# Altium schematic sheet Pico-CRSF.SchDoc: Drone RF RX & CRSF
size 420 x 297 mm; Project: Drone; ENG_APP_DATE: --/--/--; DSN_APP_DATE: --/--/--; CHK_APP_DATE: --/--/--; Date: 2024 02 04; Author: Samuel Fox; CompanyName: Exeter University; DrawnBy: Samuel Fox; Engineer: Samuel Fox; Revision: 0.1; SheetNumber: 1; SheetTotal: 1; Time: 0900
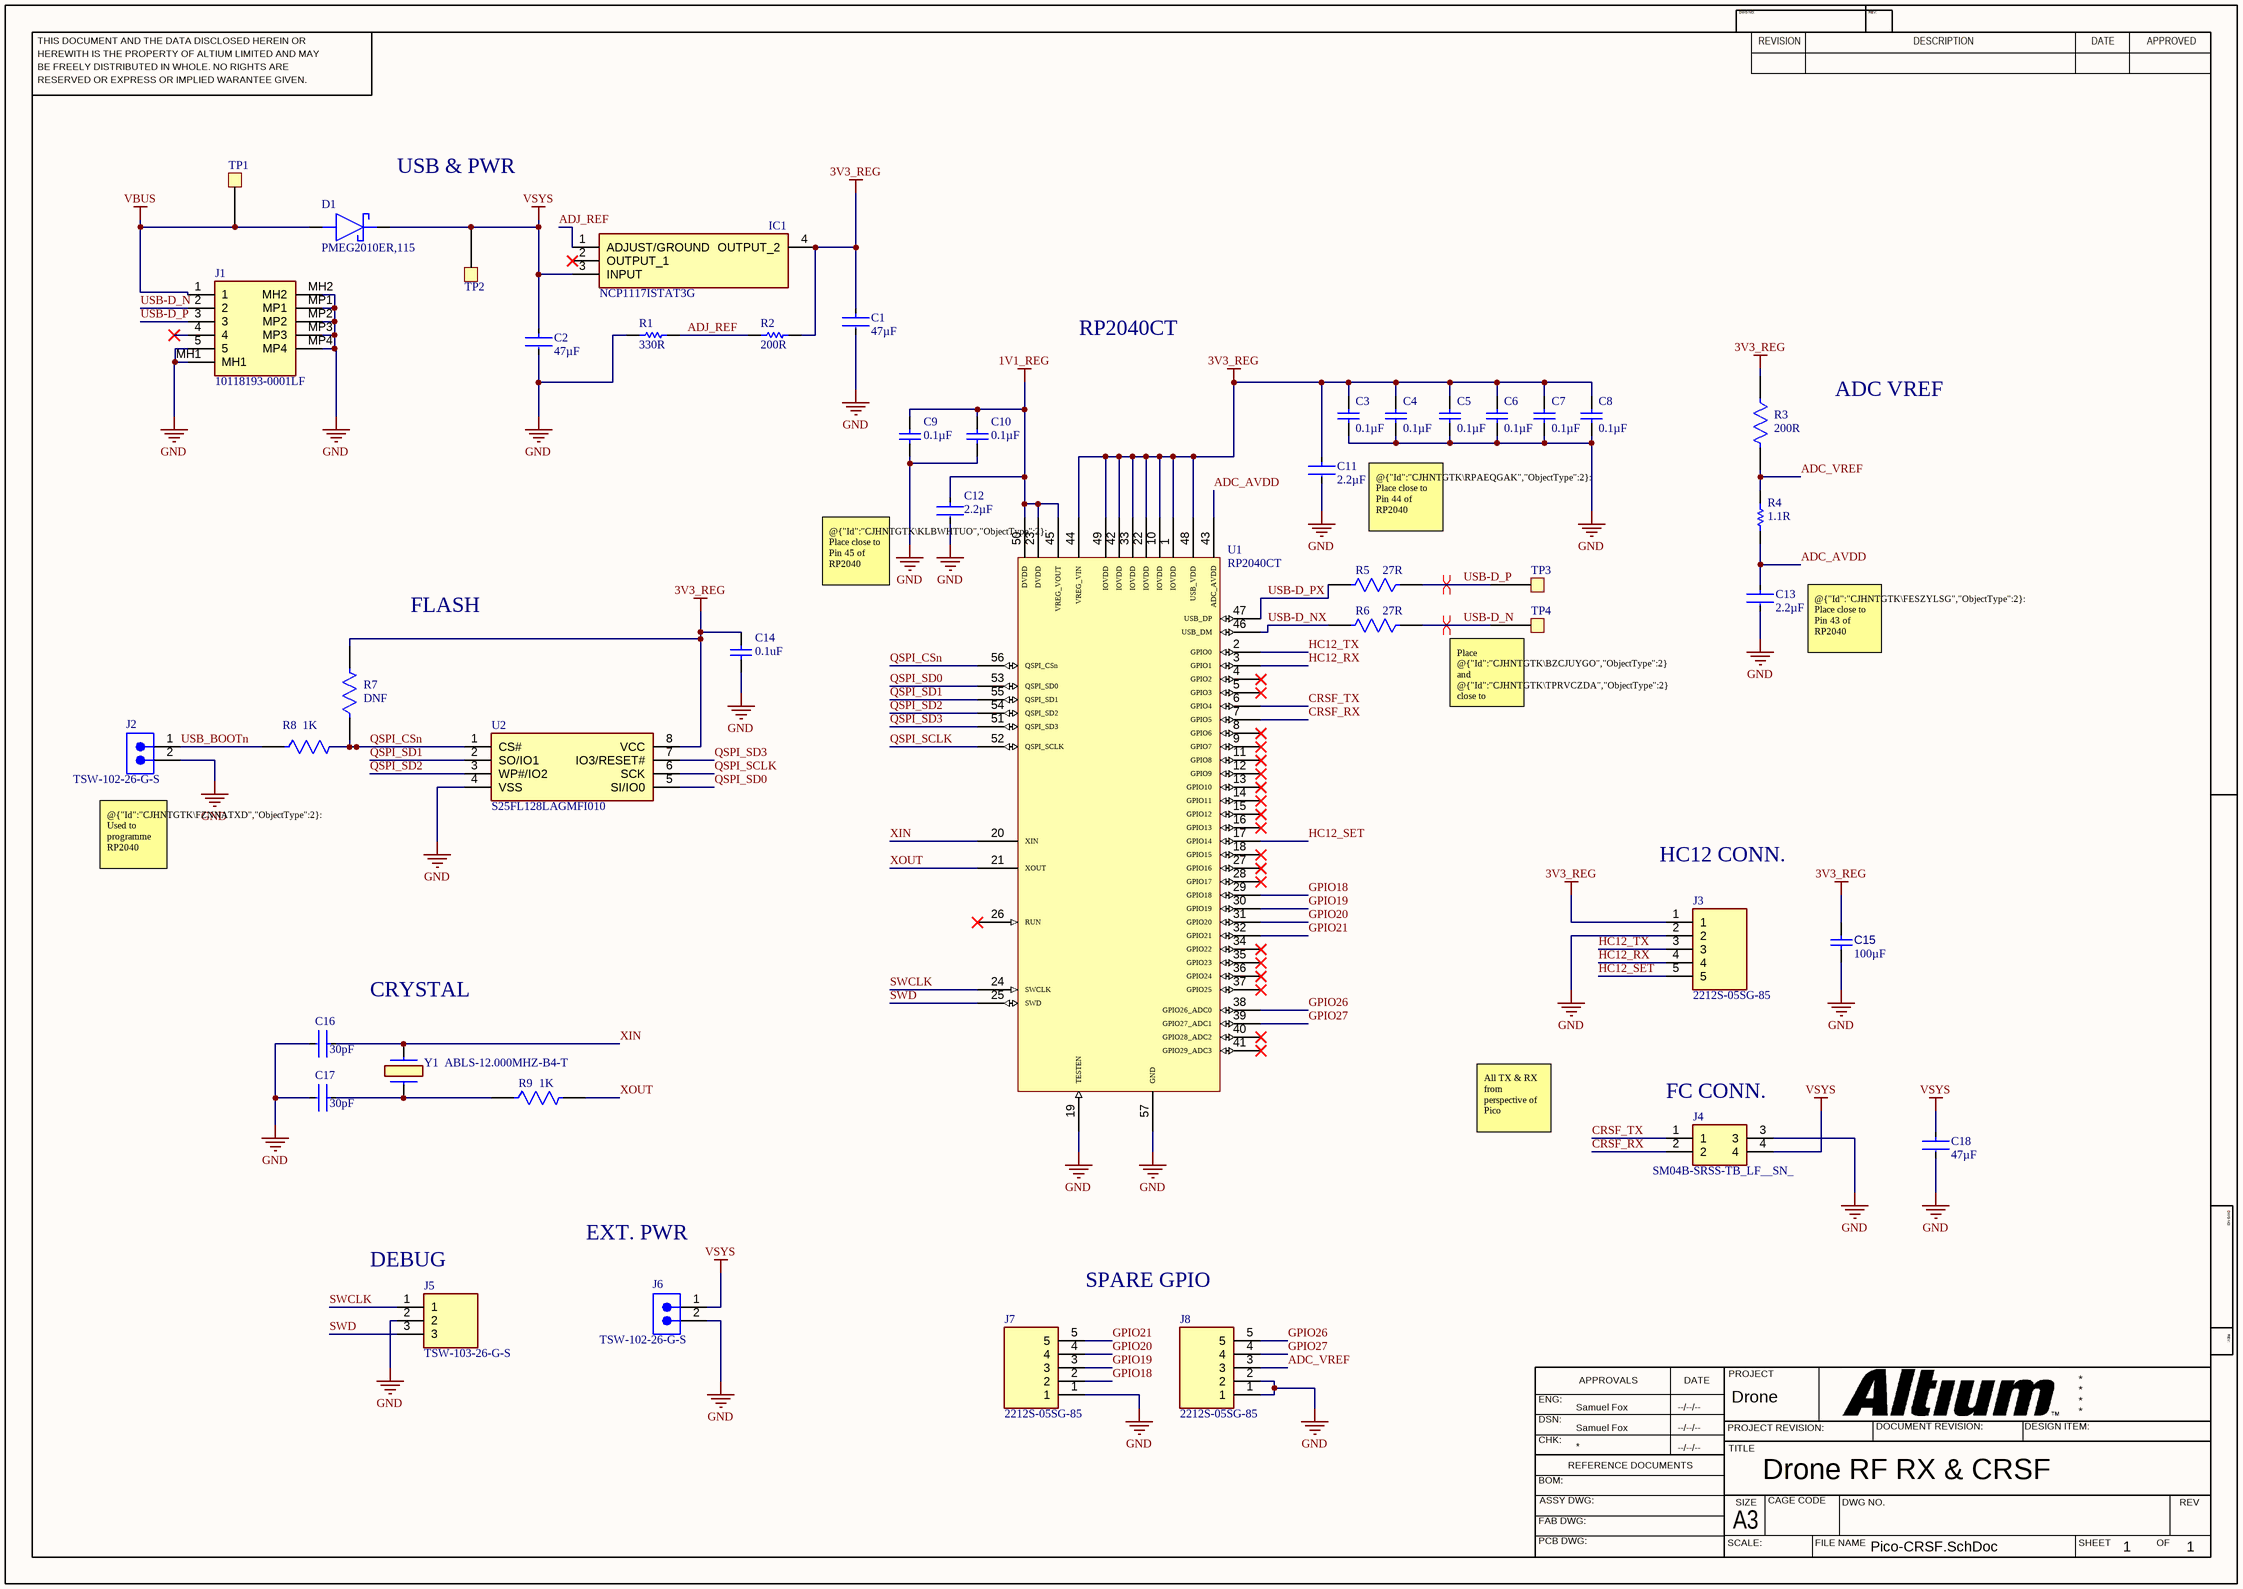
[diagram p0: Pico-CRSF.SchDoc]

## Parts
C1  value 47µF  [FP-GRT21B-0_2-MFG]  (hidden comment: GRT21BR60J476ME13L)
C2  value 47µF  [FP-GRT21B-0_2-MFG]  (hidden comment: GRT21BR60J476ME13L)
C3  value 0.1µF  [CAPC1005X56X25LL10T15]  (hidden comment: 04026D104KAT2A)
C4  value 0.1µF  [CAPC1005X56X25LL10T15]  (hidden comment: 04026D104KAT2A)
C5  value 0.1µF  [CAPC1005X56X25LL10T15]  (hidden comment: 04026D104KAT2A)
C6  value 0.1µF  [CAPC1005X56X25LL10T15]  (hidden comment: 04026D104KAT2A)
C7  value 0.1µF  [CAPC1005X56X25LL10T15]  (hidden comment: 04026D104KAT2A)
C8  value 0.1µF  [CAPC1005X56X25LL10T15]  (hidden comment: 04026D104KAT2A)
C9  value 0.1µF  [CAPC1005X56X25LL10T15]  (hidden comment: 04026D104KAT2A)
C10  value 0.1µF  [CAPC1005X56X25LL10T15]  (hidden comment: 04026D104KAT2A)
C11  value 2.2µF  [FP-GRM155-0_05-MFG]  (hidden comment: GRM155D80J225ME95D)
C12  value 2.2µF  [FP-GRM155-0_05-MFG]  (hidden comment: GRM155D80J225ME95D)
C13  value 2.2µF  [FP-GRM155-0_05-MFG]  (hidden comment: GRM155D80J225ME95D)
C14  value 0.1uF  [CAPC1005X56X25LL10T15]  (hidden comment: 04026D104KAT2A)
C15  value 100µF  [CAPC3216X16N]  (hidden comment: CL31A107MQHNNNE)
C16  value 30pF  [FP-GCM155-0_05-IPC_A]  (hidden comment: GCM1555C1H300JA16D)
C17  value 30pF  [FP-GCM155-0_05-IPC_A]  (hidden comment: GCM1555C1H300JA16D)
C18  value 47µF  [FP-GRT21B-0_2-MFG]  (hidden comment: GRT21BR60J476ME13L)
D1  PMEG2010ER,115  [PMEG2010ER115]
IC1  NCP1117ISTAT3G  [SOT230P700X180-4N]
J1  10118193-0001LF  [101181930001LF]
J2  TSW-102-26-G-S  [SMTC-TSW-102-26-XX-S]
J3  2212S-05SG-85  [RHDR5W74P0X254_1X5_1320X250X850P]
J4  SM04B-SRSS-TB_LF__SN_  [SM04B-SRSS-TB(LFSN)]
J5  TSW-103-26-G-S  [TSW-103-XX-YY-S]
J6  TSW-102-26-G-S  [SMTC-TSW-102-26-XX-S]
J7  2212S-05SG-85  [RHDR5W74P0X254_1X5_1320X250X850P]
J8  2212S-05SG-85  [RHDR5W74P0X254_1X5_1320X250X850P]
R1  value 330R  [RESC1005X40X25NL05T10]  (hidden comment: RC0402JR-07300RL)
R2  value 200R  [RESC1005X40X25NL05T10]  (hidden comment: RC0402FR-07180RL)
R3  value 200R  [FP-CR0402-IPC_C]  (hidden comment: CR0402-FX-2000GLF)
R4  value 1.1R  [RESC1005X40X25NL05T10]  (hidden comment: RC0402FR-071R)
R5  value 27R  [FP-CR0402-IPC_C]  (hidden comment: CR0402-FX-27R0GLF)
R6  value 27R  [FP-CR0402-IPC_C]  (hidden comment: CR0402-FX-27R0GLF)
R7  value DNF  [FP-CR0402-IPC_C]  (hidden comment: CR0402AFX-1001GAS)
R8  value 1K  [FP-CR0402-IPC_C]  (hidden comment: CR0402AFX-1001GAS)
R9  value 1K  [FP-CR0402-IPC_C]  (hidden comment: CR0402AFX-1001GAS)
TP1  TestPoint  [TestPoint-Footprint-1]  (value not drawn)  (no BOM)
TP2  TestPoint  [TestPoint-Footprint-1]  (value not drawn)  (no BOM)
TP3  TestPoint  [TestPoint-Footprint-1]  (value not drawn)  (no BOM)
TP4  TestPoint  [TestPoint-Footprint-1]  (value not drawn)  (no BOM)
U1  RP2040CT  [QFN40P700X700X90_HS-57N]
U2  S25FL128LAGMFI010  [SOIC127P800X216-8N]
Y1  ABLS-12.000MHZ-B4-T  [ABLS]

## Nets
1V1_REG: C9.1 C10.1 C12.1 U1.23(DVDD) U1.45(VREG_VOUT) U1.50(DVDD)
3V3_REG: C1.1 C3.1 C4.1 C5.1 C6.1 C7.1 C8.1 C11.1 C14.1 C15.1 IC1.4(OUTPUT_2) J3.1 R2.2 R3.1 R7.2 U1.1(IOVDD) U1.10(IOVDD) U1.22(IOVDD) U1.33(IOVDD) U1.42(IOVDD) U1.44(VREG_VIN) U1.48(USB_VDD) U1.49(IOVDD) U2.8(VCC)
GND: C1.2 C2.2 C3.2 C4.2 C5.2 C6.2 C7.2 C8.2 C9.2 C10.2 C11.2 C12.2 C13.2 C14.2 C15.2 C16.2 C17.2 C18.2 J1.5 J1.MH1 J1.MH2 J1.MP1 J1.MP2 J1.MP3 J1.MP4 J2.2 J3.2 J4.3 J5.2 J6.2 J7.1 J8.1 J8.2 R1.1 U1.19(TESTEN) U1.57(GND) U2.4(VSS)
VBUS: D1.2(A) J1.1 TP1.1
VSYS: C2.1 C18.1 D1.1(K) IC1.3(INPUT) J4.4 J6.1 TP2.1
ADC_AVDD: C13.1 R4.2 U1.43(ADC_AVDD)
ADC_VREF: J8.3 R3.2 R4.1
ADJ_REF: IC1.1(ADJUST/GROUND) R1.2 R2.1
CRSF_RX: J4.2 U1.7(GPIO5)
CRSF_TX: J4.1 U1.6(GPIO4)
GPIO18: J7.2 U1.29(GPIO18)
GPIO19: J7.3 U1.30(GPIO19)
GPIO20: J7.4 U1.31(GPIO20)
GPIO21: J7.5 U1.32(GPIO21)
GPIO26: J8.5 U1.38(GPIO26_ADC0)
GPIO27: J8.4 U1.39(GPIO27_ADC1)
HC12_RX: J3.4 U1.3(GPIO1)
HC12_SET: J3.5 U1.17(GPIO14)
HC12_TX: J3.3 U1.2(GPIO0)
QSPI_CSn: R7.1 R8.2 U1.56(QSPI_CSn) U2.1(CS#)
QSPI_SCLK: U1.52(QSPI_SCLK) U2.6(SCK)
QSPI_SD0: U1.53(QSPI_SD0) U2.5(SI/IO0)
QSPI_SD1: U1.55(QSPI_SD1) U2.2(SO/IO1)
QSPI_SD2: U1.54(QSPI_SD2) U2.3(WP#/IO2)
QSPI_SD3: U1.51(QSPI_SD3) U2.7(IO3/RESET#)
SWCLK: J5.1 U1.24(SWCLK)
SWD: J5.3 U1.25(SWD)
USB-D_N: J1.2 R6.1 TP4.1
USB-D_NX: R6.2 U1.46(USB_DM)
USB-D_P: J1.3 R5.1 TP3.1
USB-D_PX: R5.2 U1.47(USB_DP)
USB_BOOTn: J2.1 R8.1
XIN: C16.1 U1.20(XIN) Y1.1
XOUT: R9.2 U1.21(XOUT)
NetC17_1: C17.1 R9.1 Y1.2

Not connected (* = marked no-connect by the designer): IC1 2(OUTPUT_1)*; J1 4*; U1 4(GPIO2)* 5(GPIO3)* 8(GPIO6)* 9(GPIO7)* 11(GPIO8)* 12(GPIO9)* 13(GPIO10)* 14(GPIO11)* 15(GPIO12)* 16(GPIO13)* 18(GPIO15)* 26(RUN)* 27(GPIO16)* 28(GPIO17)* 34(GPIO22)* 35(GPIO23)* 36(GPIO24)* 37(GPIO25)* 40(GPIO28_ADC2)* 41(GPIO29_ADC3)*

## Layout directives
differential pair: USB-D_N, USB-D_P

## Notes on the sheet
- (near D1) USB & PWR
- RP2040CT
- ADC VREF
- @{"Id":"CJHNTGTK\RPAEQGAK","ObjectType":2}: Place close to Pin 44 of RP2040
- @{"Id":"CJHNTGTK\KLBWHTUO","ObjectType":2}: Place close to Pin 45 of RP2040
- FLASH
- @{"Id":"CJHNTGTK\FESZYLSG","ObjectType":2}: Place close to Pin 43 of RP2040
- (near TP4) Place @{"Id":"CJHNTGTK\BZCJUYGO","ObjectType":2} and @{"Id":"CJHNTGTK\TPRVCZDA","ObjectType":2} close to RP2040
- (near J2) @{"Id":"CJHNTGTK\FZNNATXD","ObjectType":2}: Used to programme RP2040
- HC12 CONN.
- CRYSTAL
- All TX & RX from perspective of Pico
- (near J4) FC CONN.
- (near J5) DEBUG
- EXT. PWR
- SPARE GPIO
- THIS DOCUMENT AND THE DATA DISCLOSED HEREIN OR
- HEREWITH IS THE PROPERTY OF ALTIUM LIMITED AND MAY
- DWG NO:
- REVISION
- REV:
- DESCRIPTION
- DATE
- APPROVED
- BE FREELY DISTRIBUTED IN WHOLE. NO RIGHTS ARE
- RESERVED OR EXPRESS OR IMPLIED WARANTEE GIVEN.
- ENG:
- APPROVALS
- PROJECT
- DSN:
- CHK:
- REFERENCE DOCUMENTS
- PROJECT REVISION:
- TITLE
- DOCUMENT REVISION:
- DESIGN ITEM:
- BOM:
- FAB DWG:
- PCB DWG:
- ASSY DWG:
- SCALE:
- A3
- SIZE
- CAGE CODE
- FILE NAME
- DWG NO.
- SHEET
- OF
- REV

## Library data of the parts
C1 C2 C18 = CMP-001-00084-1: Ceramic Capacitor, Multilayer, Ceramic, 6.3V, 20% +Tol, 20% -Tol, X5R, 15% TC, 47uF, Surface Mount, 0805; Max Operating Temperature: 85°C; Pins: 2; Case/Package: 0805; Mounting Technology: Surface Mount; Capacitor Type: Ceramic; Min Operating Temperature: -55°C; RoHS Compliant: Yes
C3-C10 C14 = CMP-001-00085-1: Ceramic Capacitor, Multilayer, Ceramic, 6.3V, 10% +Tol, 10% -Tol, X5R, 15% TC, 0.1uF, Surface Mount, 0402; Max Operating Temperature: 85°C; Pins: 2; Case/Package: 0402; Mounting Technology: Surface Mount; Capacitor Type: Ceramic; Min Operating Temperature: -55°C; RoHS Compliant: Yes
C11-C13 = CMP-001-00086-1: Ceramic Capacitor, Multilayer, Ceramic, 6.3V, 20% +Tol, 20% -Tol, X6T, -33/+22% TC, 2.2uF, Surface Mount, 0402; Max Operating Temperature: 105°C; Pins: 2; Case/Package: 0402; Mounting Technology: Surface Mount; Capacitor Type: Ceramic; Min Operating Temperature: -55°C; RoHS Compliant: Yes
C15 = CMP-001-00089-1: Ceramic Capacitor, Multilayer, Ceramic, 6.3V, 20% +Tol, 20% -Tol, X5R, 15% TC, 100uF, Surface Mount, 1206; Max Operating Temperature: 85°C; Pins: 2; Case/Package: 1206; Mounting Technology: Surface Mount; Capacitor Type: Ceramic; Min Operating Temperature: -55°C; RoHS Compliant: Yes
C16 C17 = CMP-001-00088-1: Ceramic Capacitor, Multilayer, Ceramic, 50V, 5% +Tol, 5% -Tol, C0G, 30ppm/Cel TC, 0.00003uF, Surface Mount, 0402; Max Operating Temperature: 125°C; Pins: 2; Case/Package: 0402; Mounting Technology: Surface Mount; Capacitor Type: Ceramic; Min Operating Temperature: -55°C; RoHS Compliant: Yes
D1 = PMEG2010ER,115: Schottky Diode; Manufacturer_Name: Nexperia; Datasheet Link: https://assets.nexperia.com/documents/data-sheet/PMEG2010ER.pdf; Height: 1.1mm; Manufacturer_Part_Number: PMEG2010ER,115; Mouser Part Number: 771-PMEG2010ER115; Mouser Price/Stock: https://www.mouser.co.uk/ProductDetail/Nexperia/PMEG2010ER115?qs=LMSg3oBIm%2FjLN28PGE8ULg%3D%3D; Arrow Part Number: PMEG2010ER,115; Arrow Price/Stock: https://www.arrow.com/en/products/pmeg2010er115/nexperia?region=nac
IC1 = NCP1117ISTAT3G: Integrated Circuit; Manufacturer_Name: onsemi; Datasheet Link: https://www.mouser.in/datasheet/2/308/NCP1117_D-2307187.pdf; Height: 1.8mm; Manufacturer_Part_Number: NCP1117ISTAT3G; Mouser Part Number: 863-NCP1117ISTAT3G; Mouser Price/Stock: https://www.mouser.co.uk/ProductDetail/onsemi/NCP1117ISTAT3G?qs=iLbezkQI%252Bsivw9bUuD01vA%3D%3D
J1 = 10118193-0001LF: Connector; Manufacturer_Name: Amphenol Communications Solutions; Datasheet Link: https://cdn.amphenol-cs.com/media/wysiwyg/files/drawing/10118193.pdf; Height: 3.3mm; Manufacturer_Part_Number: 10118193-0001LF
J2 J6 = CMP-1024-00327-1: 0.025" SQ Post Header, Through-hole, Vertical, -55 to 125 degC, 2.54 mm Pitch, 2-Pin, Male, RoHS; Manufacturer: Samtec; Pitch: 2.54 mm; Orientation: Vertical; ComponentLink3Description: Package Specification; PackageReference: TSW-102-26-XX-S; Mounting Technology: Through-hole; ComponentLink2Description: Datasheet; ComponentLink1URL: http://www.samtec.com; DatasheetVersion: F-214; ComponentLink1Description: Manufacturer URL; RoHS: True; ComponentLink2URL: http://www.samtec.com/documents/webfiles/pdf/TSW_TH.PDF; PartNumber: TSW-102-26-G-S; ComponentLink3URL: http://www.samtec.com/documents/webfiles/cpdf/TSW-XXX-XX-XXX-X-XX-XXX-MKT.pdf; PackageDescription: .025[0.64] SQ. Post Terminal Strip Assembly; PackageVersion: DM, 8/1988; Temperature Range: -55 to 125 degC
J3 J7 J8 = 2212S-05SG-85: Connector; Manufacturer_Name: Multicomp Pro; Datasheet Link: https://componentsearchengine.com/Datasheets/2/2212S-05SG-85.pdf; Height: 8.5mm; Manufacturer_Part_Number: 2212S-05SG-85
J4 = SM04B-SRSS-TB_LF__SN_: Connector; Manufacturer_Name: JST (JAPAN SOLDERLESS TERMINALS); Manufacturer_Part_Number: SM04B-SRSS-TB(LF)(SN); Datasheet Link: http://www.jst-mfg.com/product/pdf/eng/eSH.pdf; Arrow Part Number: SM04B-SRSS-TB(LF)(SN); Arrow Price/Stock: https://www.arrow.com/en/products/sm04b-srss-tb-lf-sn/jst-manufacturing?region=europe
J5 = TSW-103-26-G-S: Connector; Manufacturer_Name: SAMTEC; Datasheet Link: http://suddendocs.samtec.com/prints/tsw-xxx-xx-xxx-x-xx-xxx-mkt.pdf; Manufacturer_Part_Number: TSW-103-26-G-S
R1 = CMP-009-00179-1: Fixed Resistor, Metal Glaze/thick Film, 0.0625W, 300ohm, 50V, 5% +/-Tol, 100ppm/Cel, Surface Mount, 0402; Power: 62.5mW; Mounting Technology: Surface Mount; Max Operating Temperature: 155°C; Pins: 2; RoHS Compliant: Yes; Tolerance: 5%; Case/Package: 0402; Min Operating Temperature: -55°C
R2 = CMP-009-00178-1: Fixed Resistor, Metal Glaze/thick Film, 0.0625W, 180ohm, 50V, 1% +/-Tol, 100ppm/Cel, Surface Mount, 0402; Power: 62.5mW; Mounting Technology: Surface Mount; Max Operating Temperature: 155°C; Pins: 2; RoHS Compliant: Yes; Tolerance: 1%; Case/Package: 0402; Min Operating Temperature: -55°C
R3 = CMP-009-00180-1: Fixed Resistor, Metal Glaze/thick Film, 0.0625W, 200ohm, 50V, 1% +/-Tol, 100ppm/Cel, Surface Mount, 0402; Power: 62.5mW; Mounting Technology: Surface Mount; Max Operating Temperature: 125°C; Pins: 2; RoHS Compliant: Yes; Tolerance: 1%; Case/Package: 0402; Min Operating Temperature: -55°C
R4 = CMP-009-00181-1: Fixed Resistor, Metal Glaze/thick Film, 0.0625W, 1.1ohm, 50V, 1% +/-Tol, 200ppm/Cel, Surface Mount, 0402; Power: 62.5mW; Mounting Technology: Surface Mount; Max Operating Temperature: 155°C; Pins: 2; RoHS Compliant: Yes; Tolerance: 1%; Case/Package: 0402; Min Operating Temperature: -55°C
R5 R6 = CMP-009-00182-1: Fixed Resistor, Metal Glaze/thick Film, 0.0625W, 27ohm, 50V, 1% +/-Tol, 100ppm/Cel, Surface Mount, 0402; Power: 62.5mW; Mounting Technology: Surface Mount; Max Operating Temperature: 125°C; Pins: 2; RoHS Compliant: Yes; Tolerance: 1%; Case/Package: 0402; Min Operating Temperature: -55°C
R7-R9 = CMP-009-00177-1: Fixed Resistor, Metal Glaze/thick Film, 0.063W, 1000ohm, 50V, 1% +/-Tol, 100ppm/Cel, Surface Mount, 0402
TP1-TP4 = CMP-00030-00001-2: Test point for circuit testing.
U1 = CMP-020-00023-1: RASPBERRY-PI RP2040CT; Clock Frequency: 12MHz; Frequency: 133MHz; Case/Package: QFN-56; Pins: 56; Mounting Technology: SMD
U2 = CMP-007-000000-1: CYPRESS SEMICONDUCTOR - S25FL128LAGMFI010 - FLASH MEMORY, 128MBIT, 133MHZ, SOIC-8; Manufacturer_Name: Infineon; Geometry.Height: 2.16mm; Manufacturer_Part_Number: S25FL128LAGMFI010; Design Item ID: S25FL128LAGMFI010; Farnell Part Number: *; Farnell Price/Stock: *; Datasheet Link: http://www.cypress.com/file/316171/download; Source: S25FL128LAGMFI010.SchLib
Y1 = ABLS-12.000MHZ-B4-T: Crystal or Oscillator; Manufacturer_Name: ABRACON; Datasheet Link: https://abracon.com/Resonators/abls.pdf; Manufacturer_Part_Number: ABLS-12.000MHZ-B4-T; Mouser Part Number: 815-ABLS-12.0M-T; Mouser Price/Stock: https://www.mouser.co.uk/ProductDetail/ABRACON/ABLS-12.000MHZ-B4-T?qs=yTU0IcKoRlGSQ8ooxPPVnQ%3D%3D; Arrow Part Number: ABLS-12.000MHZ-B4-T; Arrow Price/Stock: https://www.arrow.com/en/products/abls-12.000mhz-b4-t/abracon?region=europe